# Altium schematic sheet STM32H503CBT61_STM32H503CBT6.schdoc
size A3
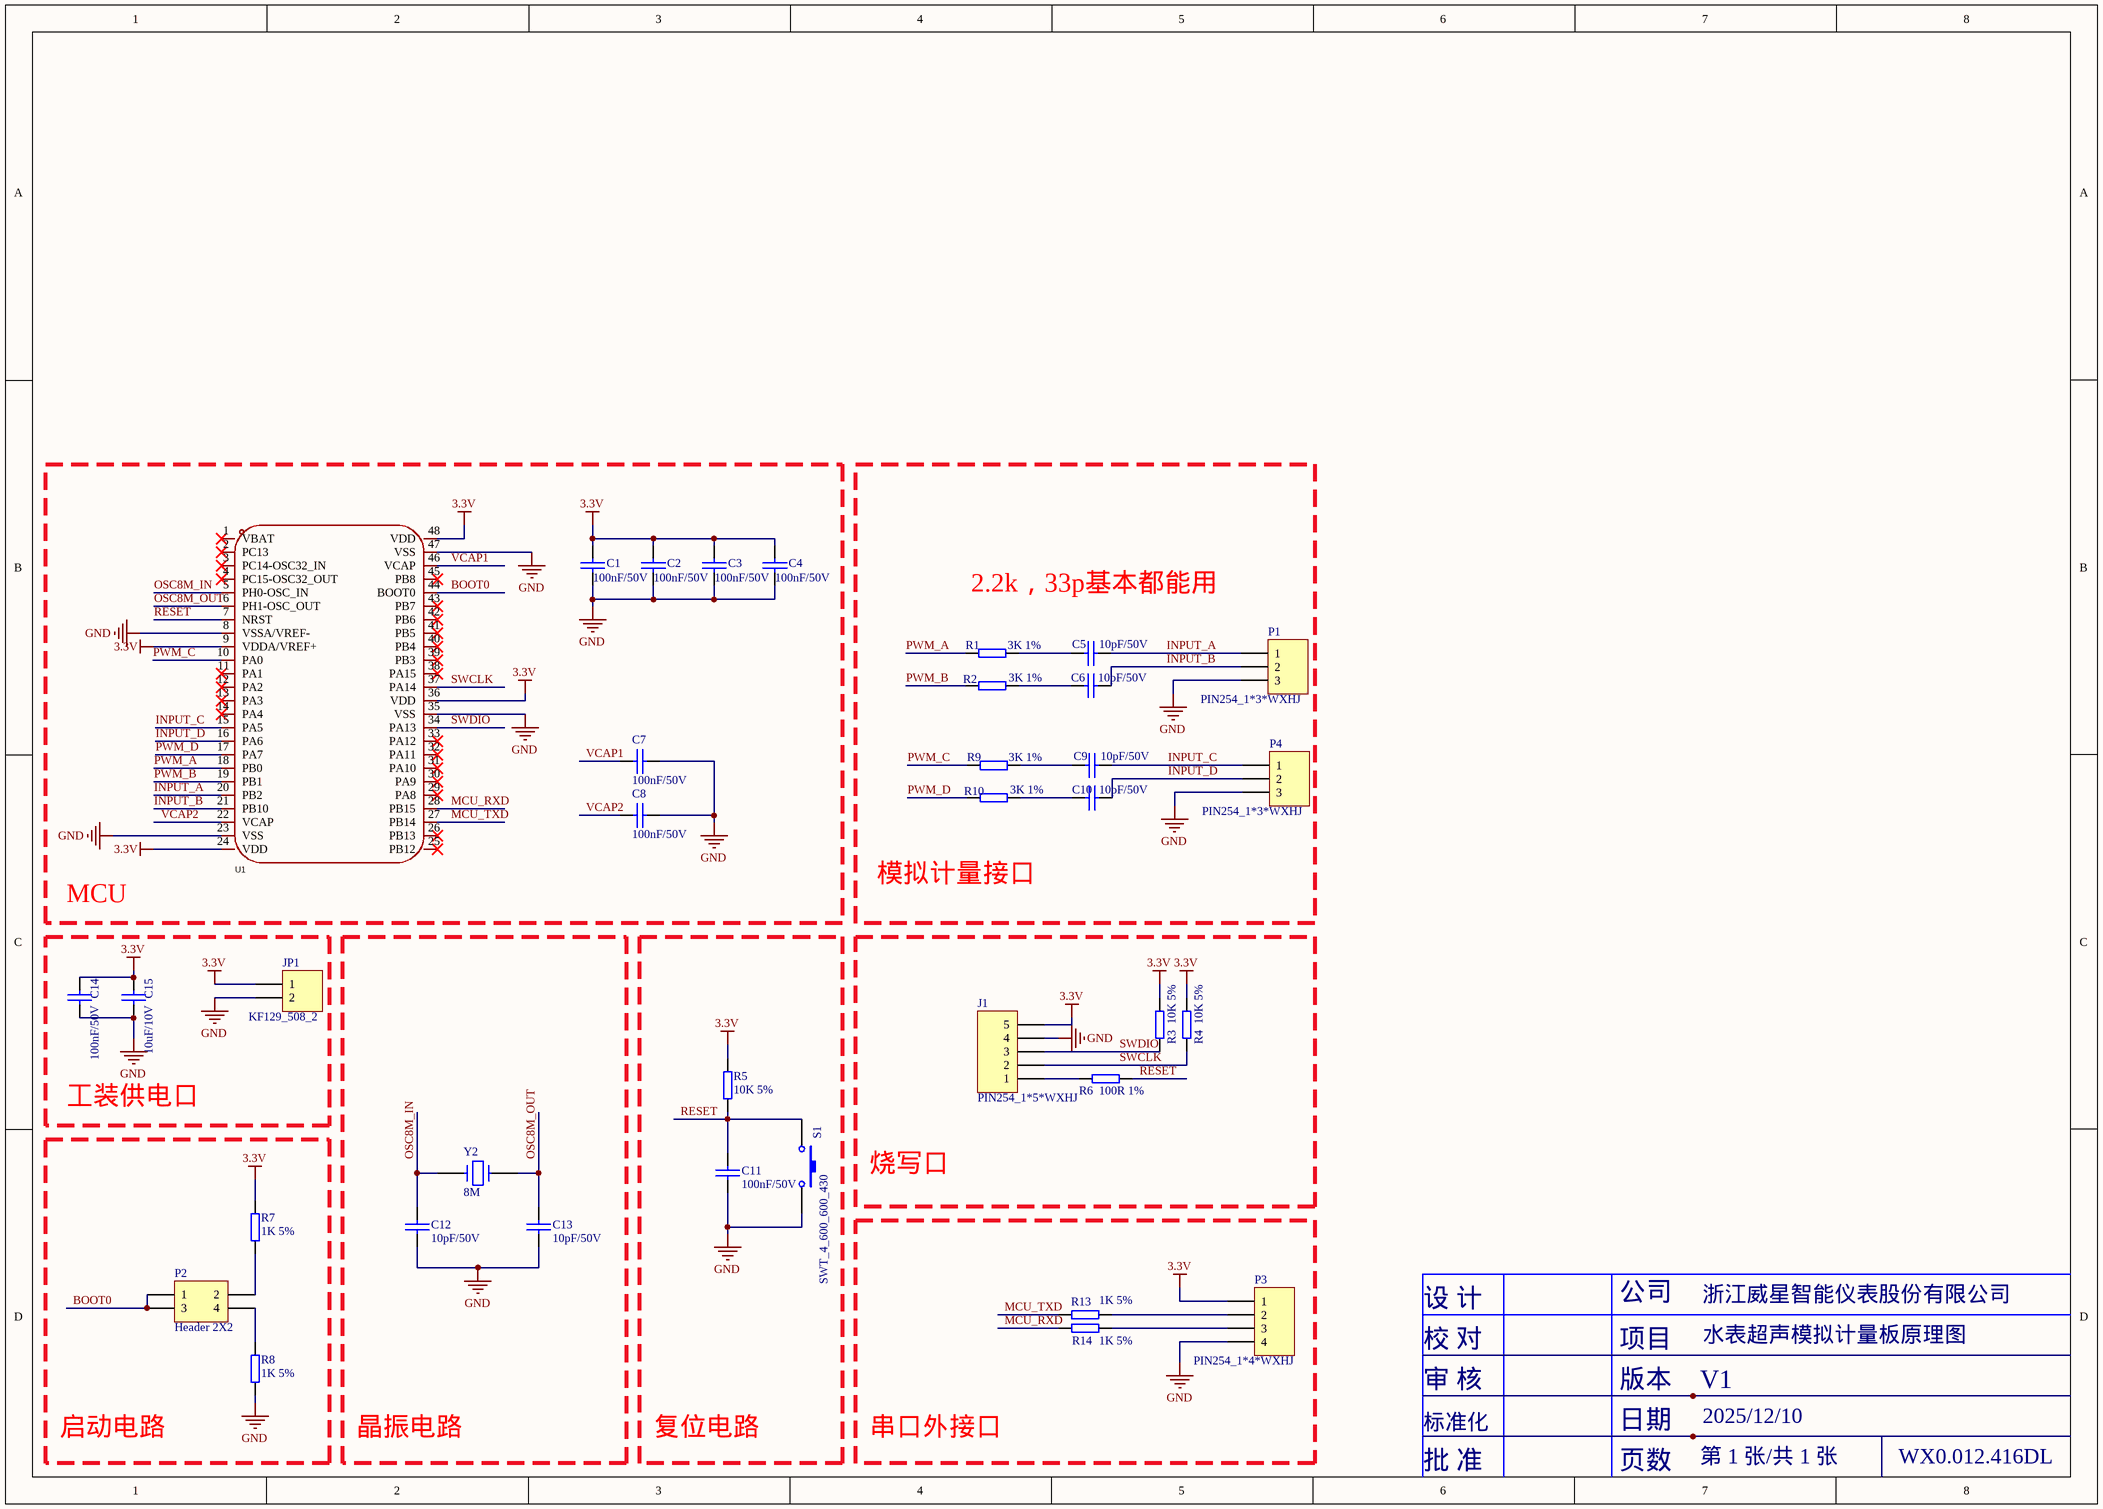
[diagram p0: STM32H503CBT61_STM32H503CBT6.schdoc]

## Parts
C1  100nF/50V  [CAP0603]
C2  100nF/50V  [CAP0603]
C3  100nF/50V  [CAP0603]
C4  100nF/50V  [CAP0603]
C5  10pF/50V  [CAP0603]
C6  10pF/50V  [CAP0603]
C7  100nF/50V  [CAP0603]
C8  100nF/50V  [CAP0603]
C9  10pF/50V  [CAP0603]
C10  10pF/50V  [CAP0603]
C11  100nF/50V  [CAP0603]
C12  10pF/50V  [CAP0603]
C13  10pF/50V  [CAP0603]
C14  100nF/50V  [CAP0603]
C15  10uF/10V  [CAP0603]
J1  PIN254_1*5*WXHJ  [PIN254_1*5*1100S]
JP1  KF129_508_2  [KF129_508_2]
P1  PIN254_1*3*WXHJ  [PIN254_1*3*1100S - duplicate]
P2  Header 2X2  [HDR2X2]
P3  PIN254_1*4*WXHJ  [PIN254_1*4*1100S]
P4  PIN254_1*3*WXHJ  [PIN254_1*3*1100S - duplicate]
R1  3K 1%  [RES0603]
R2  3K 1%  [RES0603]
R3  10K 5%  [RES0603]
R4  10K 5%  [RES0603]
R5  10K 5%  [RES0603]
R6  100R 1%  [RES0603]
R7  1K 5%  [RES0603]
R8  1K 5%  [RES0603]
R9  3K 1%  [RES0603]
R10  3K 1%  [RES0603]
R13  1K 5%  [RES0603]
R14  1K 5%  [RES0603]
S1  SWT_4_600_600_430  [SWT_4_600_600]
U1  STM32H503CBT6  [LQFP-48]  (value not drawn)
Y2  8M  [HC-49S]

## Blocks framed on the sheet
MCU: C1-C4 C7 C8 U1
工装供电口: C14 C15 JP1
晶振电路: C12 C13 Y2
复位电路: C11 R5 S1
烧写口: J1 R3 R4 R6
启动电路: P2 R7 R8
串口外接口: P3 R13 R14

## Nets
3.3V: C1.1 C2.1 C3.1 C4.1 C14.1 C15.1 J1.5 JP1.1 P3.1 R3.1 R4.1 R5.2 R7.2 U1.9(VDDA/VREF+) U1.24(VDD) U1.36(VDD) U1.48(VDD)
GND: C1.2 C2.2 C3.2 C4.2 C7.2 C8.1 C11.2 C12.2 C13.2 C14.2 C15.2 J1.4 JP1.2 P1.3 P3.4 P4.3 R8.1 S1.2 U1.8(VSSA/VREF-) U1.23(VSS) U1.35(VSS) U1.47(VSS)
BOOT0: P2.1 P2.3 U1.44(BOOT0)
INPUT_A: C5.2 P1.1 U1.20(PB2)
INPUT_B: C6.2 P1.2 U1.21(PB10)
INPUT_C: C9.2 P4.1 U1.15(PA5)
INPUT_D: C10.2 P4.2 U1.16(PA6)
MCU_RXD: R14.1 U1.28(PB15)
MCU_TXD: R13.1 U1.27(PB14)
OSC8M_IN: C12.1 U1.5(PH0-OSC_IN) Y2.1
OSC8M_OUT: C13.1 U1.6(PH1-OSC_OUT) Y2.2
PWM_A: R1.1 U1.18(PB0)
PWM_B: R2.1 U1.19(PB1)
PWM_C: R9.1 U1.10(PA0)
PWM_D: R10.1 U1.17(PA7)
RESET: C11.1 R5.1 R6.2 S1.1 U1.7(NRST)
SWCLK: J1.2 R4.2 U1.37(PA14)
SWDIO: J1.3 R3.2 U1.34(PA13)
VCAP1: C7.1 U1.46(VCAP)
VCAP2: C8.2 U1.22(VCAP)
NetC5_1: C5.1 R1.2
NetC6_1: C6.1 R2.2
NetC9_1: C9.1 R9.2
NetC10_1: C10.1 R10.2
NetJ1_1: J1.1 R6.1
NetP2_2: P2.2 R7.1
NetP2_4: P2.4 R8.2
NetP3_2: P3.2 R13.2
NetP3_3: P3.3 R14.2

Not connected (* = marked no-connect by the designer): U1 1(VBAT)* 2(PC13)* 3(PC14-OSC32_IN)* 4(PC15-OSC32_OUT)* 11(PA1)* 12(PA2)* 13(PA3)* 14(PA4)* 25(PB12)* 26(PB13)* 29(PA8)* 30(PA9)* 31(PA10)* 32(PA11)* 33(PA12)* 38(PA15)* 39(PB3)* 40(PB4)* 41(PB5)* 42(PB6)* 43(PB7)* 45(PB8)*

## Notes on the sheet
- 2.2k，33p基本都能用
- 模拟计量接口
- 设 计
- 公司
- 浙江威星智能仪表股份有限公司
- 校 对
- 审 核
- 项目
- 版本
- V1
- 水表超声模拟计量板原理图
- 标准化
- 日期
- 2025/12/10
- 批 准
- 页数
- 第 1 张/共 1 张
- WX0.012.416DL

## Library data of the parts
C1-C4 C7 C8 C11 C14 = 101020103-0021: 104pF,50 V,±10%,0603,国巨,CC0603KRX7R9BB104; Part Name: 0603贴片电容; ID: 3; SMD/DIP: SMD; Part Number: 101020103-0021
C5 C6 C9 C10 = 101020103-0027: 33pF,50 V,±10%,0603,国巨,CC0603KRNPO9BN33; Part Name: 0603贴片电容; ID: 17; SMD/DIP: SMD; Part Number: 101020103-0027
C12 C13 = 101020103-0014: 10pF,50 V,±5%,0603,X7R,国巨,CC0603JRNPO9BN100; Part Name: 0603贴片电容; ID: 7; SMD/DIP: SMD; Part Number: 101020103-0014
C15 = 101020103-0026: 106pF,10 V,±10%,0603,村田,GRM188R61A106KE47D; Part Name: 0603贴片电容; ID: 8; SMD/DIP: SMD; Part Number: 101020103-0026
J1 = AD_WXHJ_PinHeader_02: 1*5 ，Φ1.0 ，2.54mm，直脚,无需焊接器件; Part Name: 排针; ID: 17; SMD/DIP: DIP; Part Number: AD_WXHJ_PinHeader_02
JP1 = 1010904-0015: KF129-2P,螺丝紧固,2,ABS,松涛; Part Name: 接线端子; ID: 7; SMD/DIP: DIP; Part Number: 1010904-0015
P1 P4 = AD_WXHJ_PinHeader_01: 1*3 ，Φ1.0 ，2.54mm，直脚,无需焊接器件; Part Name: 排针; ID: 16; SMD/DIP: DIP; Part Number: AD_WXHJ_PinHeader_01
P2 = Header 2X2: Header, 4-Pin, Dual row
P3 = AD_WXHJ_PinHeader_01: 1*4 ，Φ1.0 ，2.54mm，直脚,无需焊接器件; Part Name: 排针; ID: 16; SMD/DIP: DIP; Part Number: AD_WXHJ_PinHeader_01
R1 R2 R9 R10 = 101010103-0059: 3.3K±1%,1/10W,0603; Part Name: 0603贴片电阻; ID: 40; SMD/DIP: SMD; Part Number: 101010103-0059
R3-R5 = 101010103-0003: 国巨,±5%,0603,,155 ℃,-55 ℃,RC0603JR-0710KL,无铅,200 ppm/℃,1/10W,,10K; Part Name: 0603贴片电阻; ID: 7; SMD/DIP: SMD; Part Number: 101010103-0003
R6 = 101010103-0041: 100Ω,±1%,1/10W,0603,国巨股份有限公司,RC0603FR-07100RL; Part Name: 0603贴片电阻; ID: 4; SMD/DIP: SMD; Part Number: 101010103-0041
R7 R8 R13 R14 = 101010103-0008: 1K,±5%,1/10W,0603,国巨,RC0603JR-071KL; Part Name: 0603贴片电阻; ID: 10; SMD/DIP: SMD; Part Number: 101010103-0008
S1 = 1011001-0027: TS-1102,机械轻触,6*6*4.3直插,6*6*4.3直插,乐清市羽欧电子; Part Name: 按键; ID: 32; SMD/DIP: DIP; Part Number: 1011001-0027
U1 = STM32H503CBT6: Manufacturer: ST(意法半导体); Add into BOM: yes; Symbol: STM32H503CBT6; Device: STM32H503CBT6; LCSC Part Name: STM32H503CBT6; Supplier Part: C17700273; Manufacturer Part: STM32H503CBT6; Supplier Footprint: LQFP-48(7x7); JLCPCB Part Class: Extended Part; Datasheet: https://atta.szlcsc.com/upload/public/pdf/source/20240910/D4990ECC418F560B9DBCE13634236E70.pdf; Supplier: LCSC; Convert to PCB: yes; Comment_1: STM32H503CBT6
Y2 = 1010601-0007: 8M,HC-49,8M,100 ppm/℃,无源,红星,8M无源晶振; Part Name: 晶振; ID: 21; SMD/DIP: DIP; Part Number: 1010601-0007